# Altium schematic sheet Sheet1.SchDoc
size A4
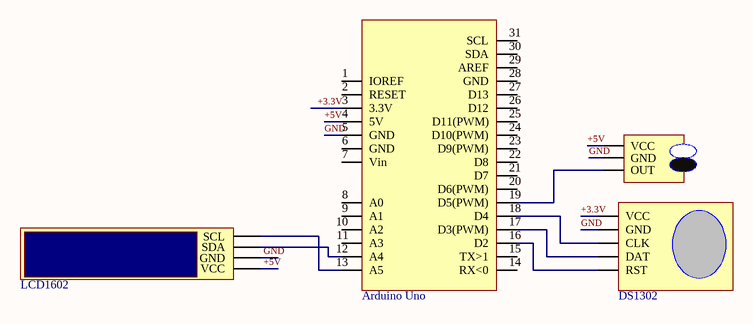
[diagram p0: Sheet1.SchDoc]

## Parts
Arduino  Arduino Uno
LCD1602  IIC1602  (value not drawn)
rtc  DS1302
红外避障  红外避障1  (value not drawn)

## Nets
+3.3V: Arduino.3(3.3V) rtc.241(VCC)
+5V: Arduino.4(5V) LCD1602.192(VCC) 红外避障.233(VCC)
GND: Arduino.5(GND) LCD1602.193(GND) rtc.242(GND) 红外避障.234(GND)
NetArduino_12: Arduino.12(A4) LCD1602.194(SDA)
NetArduino_13: Arduino.13(A5) LCD1602.195(SCL)
NetArduino_16: Arduino.16(D2) rtc.245(RST)
NetArduino_17: Arduino.17(D3(PWM)) rtc.244(DAT)
NetArduino_18: Arduino.18(D4) rtc.243(CLK)
NetArduino_19: Arduino.19(D5(PWM)) 红外避障.235(OUT)

Not connected (* = marked no-connect by the designer): Arduino 1(IOREF) 2(RESET) 6(GND) 7(Vin) 8(A0) 9(A1) 10(A2) 11(A3) 14(RX<0) 15(TX>1) 20(D6(PWM)) 21(D7) 22(D8) 23(D9(PWM)) 24(D10(PWM)) 25(D11(PWM)) 26(D12) 27(D13) 28(GND) 29(AREF) 30(SDA) 31(SCL)

## Library data of the parts
Arduino = Arduino_C
rtc = RTC时钟
红外避障 = 红外避障